# EAGLE design USB2.0 (EAGLE 9.6.1)
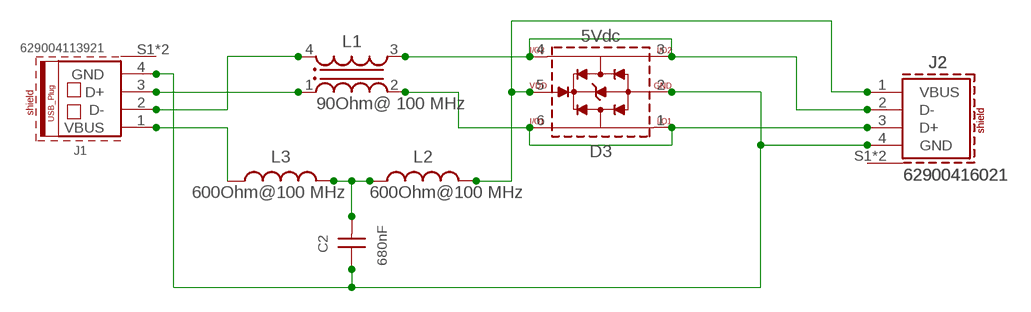
[diagram p0: schematic, sheet 1]

## Parts
C2  680nF  WCAP-CSGP_0603_885012206051_16V(DC)_R  [WCAP-CSGP_0603_R]
D3  5Vdc  WE-TVS-HS_SOT23-6L_82400102  [WE-TVS_SOT23-6L]
J1  629004113921  [629004113921]
J2  62900416021  [62900416021]
L1  90Ohm@ 100 MHz  WE-CNSW_1206_744232090  [WE-CNSW_1206]
L2  600Ohm@100 MHz  WE-CBF_0603_742792651_HC  [WE-CBF_0603(W=2.6)]
L3  600Ohm@100 MHz  WE-CBF_0603_742792651_HC  [WE-CBF_0603(W=2.6)]

## Nets
D_N: D3.3(I/O2) D3.4(I/O4) J2.2(D-) L1.3
D_P: D3.1(I/O1) D3.6(I/O3) J2.3(D+) L1.2
DX_N: J1.2(D-) L1.4
DX_P: J1.3(D+) L1.1
N$1: D3.5(VDD) J2.1(VBUS) L2.2
N$2: C2.1 D3.2(GND) J1.4(GND) J2.4(GND)
N$5: J1.1(VBUS) L3.1
N$7: C2.2 L2.1 L3.2
Unconnected: J1.S1(SHIELD) J1.S2(SHIELD) J2.S1(SHIELD) J2.S2(SHIELD)

## Library data of the parts
C2 = Wurth_Capacitors_WCAP-CSGP:WCAP-CSGP_0603: WCAP-CSGP MLCCs 0603 General Purpose Characteristics General purpose product series High performance ceramic High electrical precision and stability ceramic especially for NP0 Minimal aging especially for NP0 Mounting style: SMT-Chip Ceramic: NP0 (Class I), X5R (Class II), X7R (Class II) Capacitance range: 1 pF ‒ 10 µF Temperature Coefficient: ±30 ppm/°C; ±0.54 % for NP0 ±15 % for X7R and X5R Voltage range (UR): 6.3 ‒ 100 V(DC) Operating temperature: -55 °C up to + 125 °C for NP0 and X7R -55 °C up to + 85 °C for X5R Termination: Cu/Ni/Sn Recommended soldering: Reflow and wave soldering Applications Temperature compensation (NP0) Coupling Decoupling Bypass Smoothing Filtering Resonant circuit <https://www.we-online.com/catalog/media/o177837v209%20MLCC_GRP_all.jpg> Details see: https://www.we-online.com/catalog/en/pbs/capacitors/multilayer_ceramic_chip_capacitors/mlcc_general_purpose Updated by Ella Wu 2022-06-20 2022(C) Würth Elektronik; CERAMIC-TYPE: X7R Class II; DATASHEET-URL: https://www.we-online.com/redexpert/spec/885012206051?ae; DF: 0.1; HEIGHT: 0.8mm; MOUNT: SMT; OPERATING-TEMPERATURE: -55 up to +125 °C; PART-NUMBER: 885012206051; QMIN: -; RISO: 0.7GOhm; SIZE: 0603; TECHNICAL-REFERENCE: X7R0603684K016DFCT10000; VR: 16V(DC)
D3 = Wurth_EMC Components_WE-TVS:WE-TVS-HS_SOT23-6L_82400102: WE-TVS TVS Diode – High Speed Series Characteristics Low clamping voltage Sturdy design Very low capacitance Flow Thru Design for a simple layout Rail to Rail protection Epoxy flame resistant UL94-V0 RoHS, REACH and free of halogens Applications Very fast data lines USB 2.0 Ethernet PoE VGA Sim Cards Keypads HS = High Speed <https://www.we-online.com/catalog/media/o14883v209%20Family_WE-TVS_HIGHSPEED.jpg> Details see: https://www.we-online.com/catalog/en/WE-TVS-HS Updated by Ella Wu 2021-12-16 2021(C) Wurth Elektronik; C-CH: 2pF; CHANNELS: 2+1; DATASHEET-URL: https://www.we-online.com/catalog/datasheet/82400102.pdf; IPEAK: 7A; MOUNT: SMT; PART-NUMBER: 82400102; VBR: 6V
J1 = Eagle_WR-USB (rev22a):629004113921: WR-COM USB 2.0 Plug Type A SMT w. Clip Kind Properties Durability:1 500 Mating cycles Connector Type:USB Gender:Plug Type:Horizontal General Information Operating Temperature:-55 up to +105 °C Electrical Properties Working Voltage:30V (AC) Withstanding Voltage:750 V (AC) Contact Resistance:20 mΩ Material Properties Insulator Material:LCP Insulator Flammability Rating:UL94 V-0 Insulator Color:Black Contact Material:Copper Alloy Contact Plating:Selective Gold Contact Type:Stamped Shielding Material:Brass Shielding Plating:Nickel <https://www.we-online.com/catalog/media/o32993v209%20Family_WR-COM_629004113921.jpg> Details see: https://www.we-online.com/catalog/en/COM_PLUG_SMT_TYPE_A_W_CLIP/ Updated by Yingchun, Shan 2020-01-14 2020 (C) Würth Elektronik; APPLICATION: USB 2.0; DATASHEET-URL: https://www.we-online.com/catalog/datasheet/629004113921.pdf; GERDER: Plug; INTERFACE-TYPE: Type A; IR1: 1.5A; MOUNT: SMT; PACKAGING: Tube; PART-NUMBER: 629004113921; PINS: 4; TYPE: Horizontal; WORKING-VOLTAGE: 30V(AC)
J2 = Wurth_Connectors_WR-USB:62900416021: WR-COM USB 2.0 SMT Type A Horizontal Kind Properties Durability:1500 Mating cycles Quality Class:1500 Mating cycles Connector Type:USB 2.0 Gender:Receptacle Type:Horizontal General Information Operating Temperature:-40 up to +85 °C Compliance:RoHS Electrical Properties IR 1:1.5A Working Voltage:30V (AC) Withstanding Voltage:750 V (AC) Contact Resistance:20 mΩ Material Properties Insulator Material:PA6T Insulator Flammability Rating:UL94 V-0 Color:Black Cover Material:Brass Cover Plating:Nickel Contact Material:Copper Alloy Contact Plating:Selective Gold Contact Type:Stamped Shielding Material:Brass Shielding Plating:Nickel <https://www.we-online.com/catalog/media/o32995v209%20Family_WR-COM_62900416021.jpg> Details see: https://www.we-online.com/catalog/en/COM_SMT_TYPE_A_HORIZONTAL/ Updated by Yingchun, Shan 2020-01-15 2020 (C) Würth Elektronik; APPLICATION: USB 2.0; DATASHEET-URL: https://www.we-online.com/catalog/datasheet/62900416021.pdf; GERDER: Receptacle; INTERFACE-TYPE: Type A; IR1: 1.5A; MOUNT: SMT; PACKAGING: Tray; PART-NUMBER: 62900416021; PINS: 4; TYPE: Horizontal; WORKING-VOLTAGE: 30V(AC)
L1 = Wurth_EMC Components_WE-CNSW:WE-CNSW_1206: WE-CNSW SMD Common Mode Line Filter Characteristics Current compensated data line filter High common mode noise suppression at high frequencies Small influence on high speed signals through winding symmetry Climatic category 40/105/21 (Size 0603) Climatic category 40/125/21 (Size 0805/1206/1812) Flammability corresponding to UL 94 V-0 Applications USB 2.0 IEEE 1394 (Firewire) LVDS High Speed Data Lines LAN <https://katalog.we-online.com/media/images/v2/o14771v209%20we-cnsw_stroko_smd_gruppe.jpg> Details see: http://katalog.we-online.de/en/pbs/WE-CNSW Updated by Ella Wu 2019-01-09 2019 (C) Wurth Elektronik; DATASHEET-URL: https://katalog.we-online.com/pbs/datasheet/744232090.pdf; IR: 370mA; MOUNT: SMT; PART-NUMBER: 744232090; RDC: 0.3Ohm; VR: 50V; VT: 125 V (DC)
L2 L3 = Wurth_EMC Components_WE-CBF:WE-CBF_0603: WE-CBF SMD EMI Suppression Ferrite Bead Characteristics Reliable Ni-Sn electrodes High rated current up to 6 A Operating temperature: –55 ºC to +125 ºC Applications Perfect as data lined filter and for uncoupling of distribution voltage Package name and Variant abbreviation: Package: Wide Band /High Speed: W=Width= 2.2 High Current: W=Width= 2.6 Variant abbreviation: WB = Wide Band HS=High Speed HC=High Current <https://www.we-online.com/catalog/media/o14753v209%20Family_WE-CBF.jpg> Details see: https://www.we-online.com/katalog/en/WE-CBF Updated by Ella Wu 2021-1-12 2021(C) Wurth Elektronik; DATASHEET-URL: https://www.we-online.com/catalog/datasheet/742792651.pdf; IR2: 1000mA; MOUNT: SMT; PART-NUMBER: 742792651; RDC-MAX: 0.2Ohm; TYPE: High Current; Z-MAX: 800Ohm@200 MHz

## Board
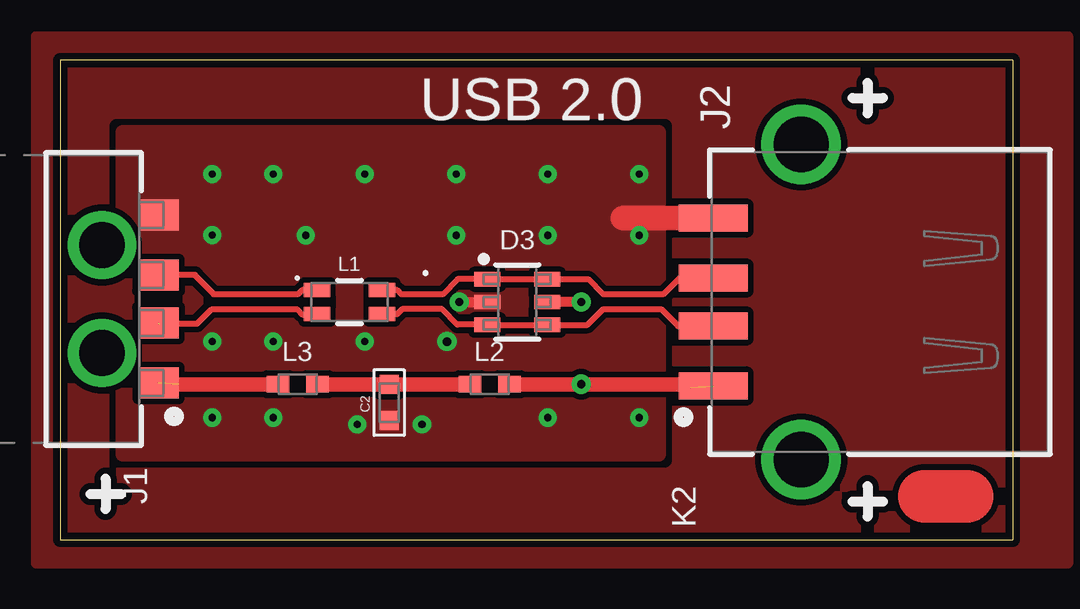
[diagram p1: board, top side]
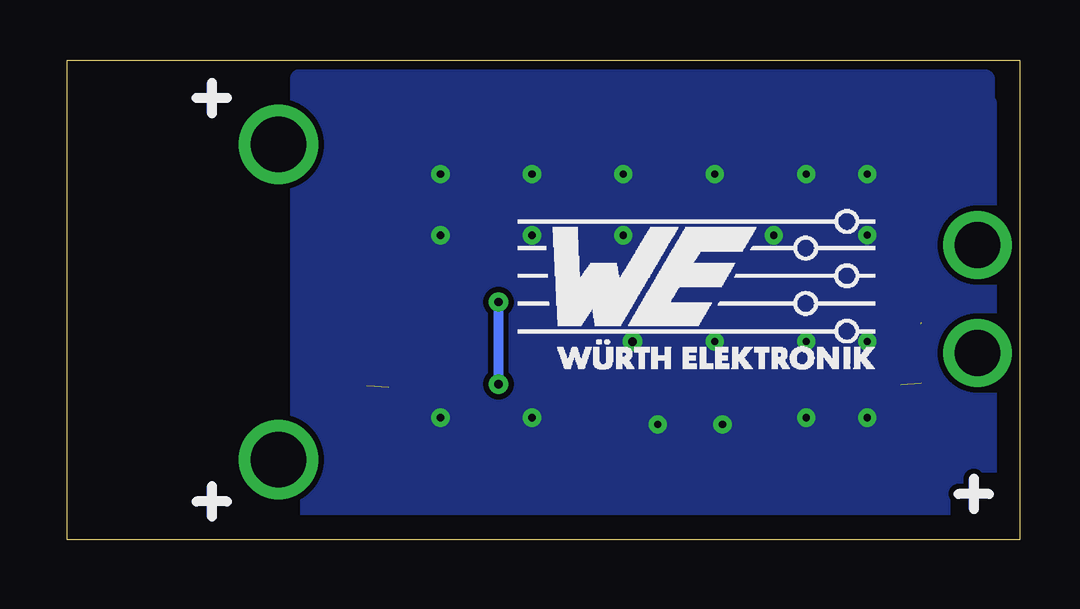
[diagram p2: board, bottom side, seen from below]

Size 39.7 x 20 mm. Coordinates in mm from the lower left corner, seen from the top.
Outline: 39.7,16.66 39.7,20 0,20 0,0 39.7,0 39.7,17.25
Copper layers (1*2+3*4+5*6+7*16): Top 0.035mm / dielectric 0.2mm / Route2 0.035mm / dielectric 0.15mm / Route3 0.035mm / dielectric 0.2mm / Route4 0.035mm / dielectric 0.15mm / Route5 0.035mm / dielectric 0.2mm / Route6 0.035mm / dielectric 0.15mm / Route7 0.035mm / dielectric 0.2mm / Bottom 0.035mm
Design rules "Eagle_WEdirekt_150_check *": minimum track width 6mil, minimum drill 0.2mm, track to track 9mil, track to pad 9mil, pad to pad 12mil, via to via 12mil, smd to smd 12mil, copper to edge 12mil, drill to drill 24mil, minimum pad ring 9mil, minimum via ring 9mil, stop-mask expansion 3mil, vias tented up to drill 0.6mm, thermal gap 12mil

### Footprints (pad centres in the part's own frame; a part is rotated, then mirrored left to right if it is on the bottom)
WCAP-CSGP_0603_R = smd 0.8 x 0.8: 1 -0.75,0; 2 0.75,0
WE-TVS_SOT23-6L = smd 0.6 x 1.1: 1 -0.95,-1.25; 2 0,-1.25; 3 0.95,-1.25; 4 0.95,1.25; 5 0,1.25; 6 -0.95,1.25
629004113921 = smd 1.3 x 1.7: 1 3.5,10.2; 2 1,10.2; 3 -1,10.2; 4 -3.5,10.2 | drill 1.9: S1 -2.25,7.85; S2 2.25,7.85
62900416021 = smd 1.12 x 2.88: 1 -3.5,6.95; 2 -1,6.95; 3 1,6.95; 4 3.5,6.95 | drill 2.3: S1 -6.57,3.28; S2 6.57,3.28
WE-CNSW_1206 = smd 1.1 x 0.6: 1 -1.35,0.5; 2 1.35,0.5; 3 1.35,-0.5; 4 -1.35,-0.5
WE-CBF_0603(W=2.6) = smd 0.95 x 0.7: 1 -0.825,0; 2 0.825,0

### Placement (x,y rotation side)
C2  13.72,5.71 90 top
D3  19.05,9.91 270 top
J1  -6.1,10.03 270 top
J2  34.16,9.91 90 top
L1  12.06,9.91 0 top
L2  17.91,6.48 0 top
L3  9.91,6.48 0 top

### Tracks (layer width: path | path; a pad name or v marks a point on that pad's centre or on a via)
D_N
  Top 0.254: L1.3 14.05,9.41 14.25,9.61 15.92,9.61 16.56,8.97 D3.3 D3.4 21.98,8.96 22.64,9.61 25.05,9.61 25.75,8.91 J2.2
D_P
  Top 0.254: L1.2 14.05,10.41 14.23,10.23 15.94,10.23 16.57,10.86 D3.1 D3.6 22,10.86 22.64,10.22 25.13,10.22 25.82,10.91 J2.3
DX_N  (1 unrouted)
  Top 0.254: 4.13,8.99 5.7,8.99 6.3,9.59 9.9,9.59 10.12,9.37 10.68,9.37 L1.4
DX_P
  Top 0.152: 5.65,11 5.62,11.03
  Top 0.254: 5.65,11 6.4,10.25 6.4,10.22 9.9,10.22 10.09,10.41 L1.1 | 5.62,11.03 J1.3
N$1  (via drill 0.35)  (1 unrouted)
  Top 0.152: 26.16,6.48 26.29,6.35
  Top 0.406: v21.72,9.91 D3.5
  Top 0.61: L2.2 v21.72,6.48 26.16,6.48
  Bottom 0.406: v21.72,9.91 v21.72,6.48
N$2  (via drill 0.3, 0.35)
  Top 0.152: 23.46,13.41 23.45,13.4
  Top 0.406: v16.64,9.91 D3.2
  Top 1.016: J2.4 23.46,13.41
  other vias: 15.08,4.8 12.38,4.8 8.89,15.24 24.13,5.08 20.32,5.08 8.89,5.08 6.35,15.24 6.35,5.08 6.35,12.7 8.89,8.26 12.7,8.26 6.35,8.26 16.13,8.26 12.7,15.24 16.51,15.24 20.32,15.24 24.13,15.24 10.24,12.69 16.51,12.69 20.32,12.69 24.13,12.69
  pour Bottom (no thermals): 1.45,18.17 1.35,18.17 1.35,1.4 29.99,1.43 29.99,19.22 1.43,19.19 1.43,18.38
  pour Top (rank 2, no thermals): 3.22,3.56 24.94,3.56 24.94,17 2.62,17 2.62,3.55 2.99,3.55
N$5  (1 unrouted)
  Top 0.61: L3.1 4.95,6.48
N$7
  Top 0.152: 13.7,6.48 C2.2 | 17.07,6.46 L2.1
  Top 0.61: L3.2 13.7,6.48 | C2.2 17.07,6.46
S$1
  Top 0.406: 33.66,19.05 33.66,17.78
S$2
  pour Top (isolate 0.254, rank 3, no thermals): -1,21 42,21 42,-1 -1,-1
S$3
  Top 0.406: 33.02,18.41 34.29,18.41
S$4
  Bottom 0.406: 33.02,18.41 34.29,18.41
S$5
  Bottom 0.406: 33.66,17.78 33.66,19.05
S$6
  Top 0.406: 33.66,2.22 33.66,0.95
S$7
  Top 0.406: 33.02,1.59 34.29,1.59
S$8
  Bottom 0.406: 33.02,1.59 34.29,1.59
S$9
  Bottom 0.406: 33.66,0.95 33.66,2.22
S$10
  Top 0.406: 1.91,2.54 1.91,1.27
S$11
  Top 0.406: 1.27,1.91 2.54,1.91
S$12
  Bottom 0.406: 1.27,1.91 2.54,1.91
S$13
  Bottom 0.406: 1.91,1.27 1.91,2.54
S$17
  Top 2.184: 36.02,1.8 37.8,1.8

### Text on the board
tPlace: USB 2.0
tNames: K2
Measures: 20,0 mm | 39,7 mm